# Altium schematic sheet RX.SchDoc
size A3
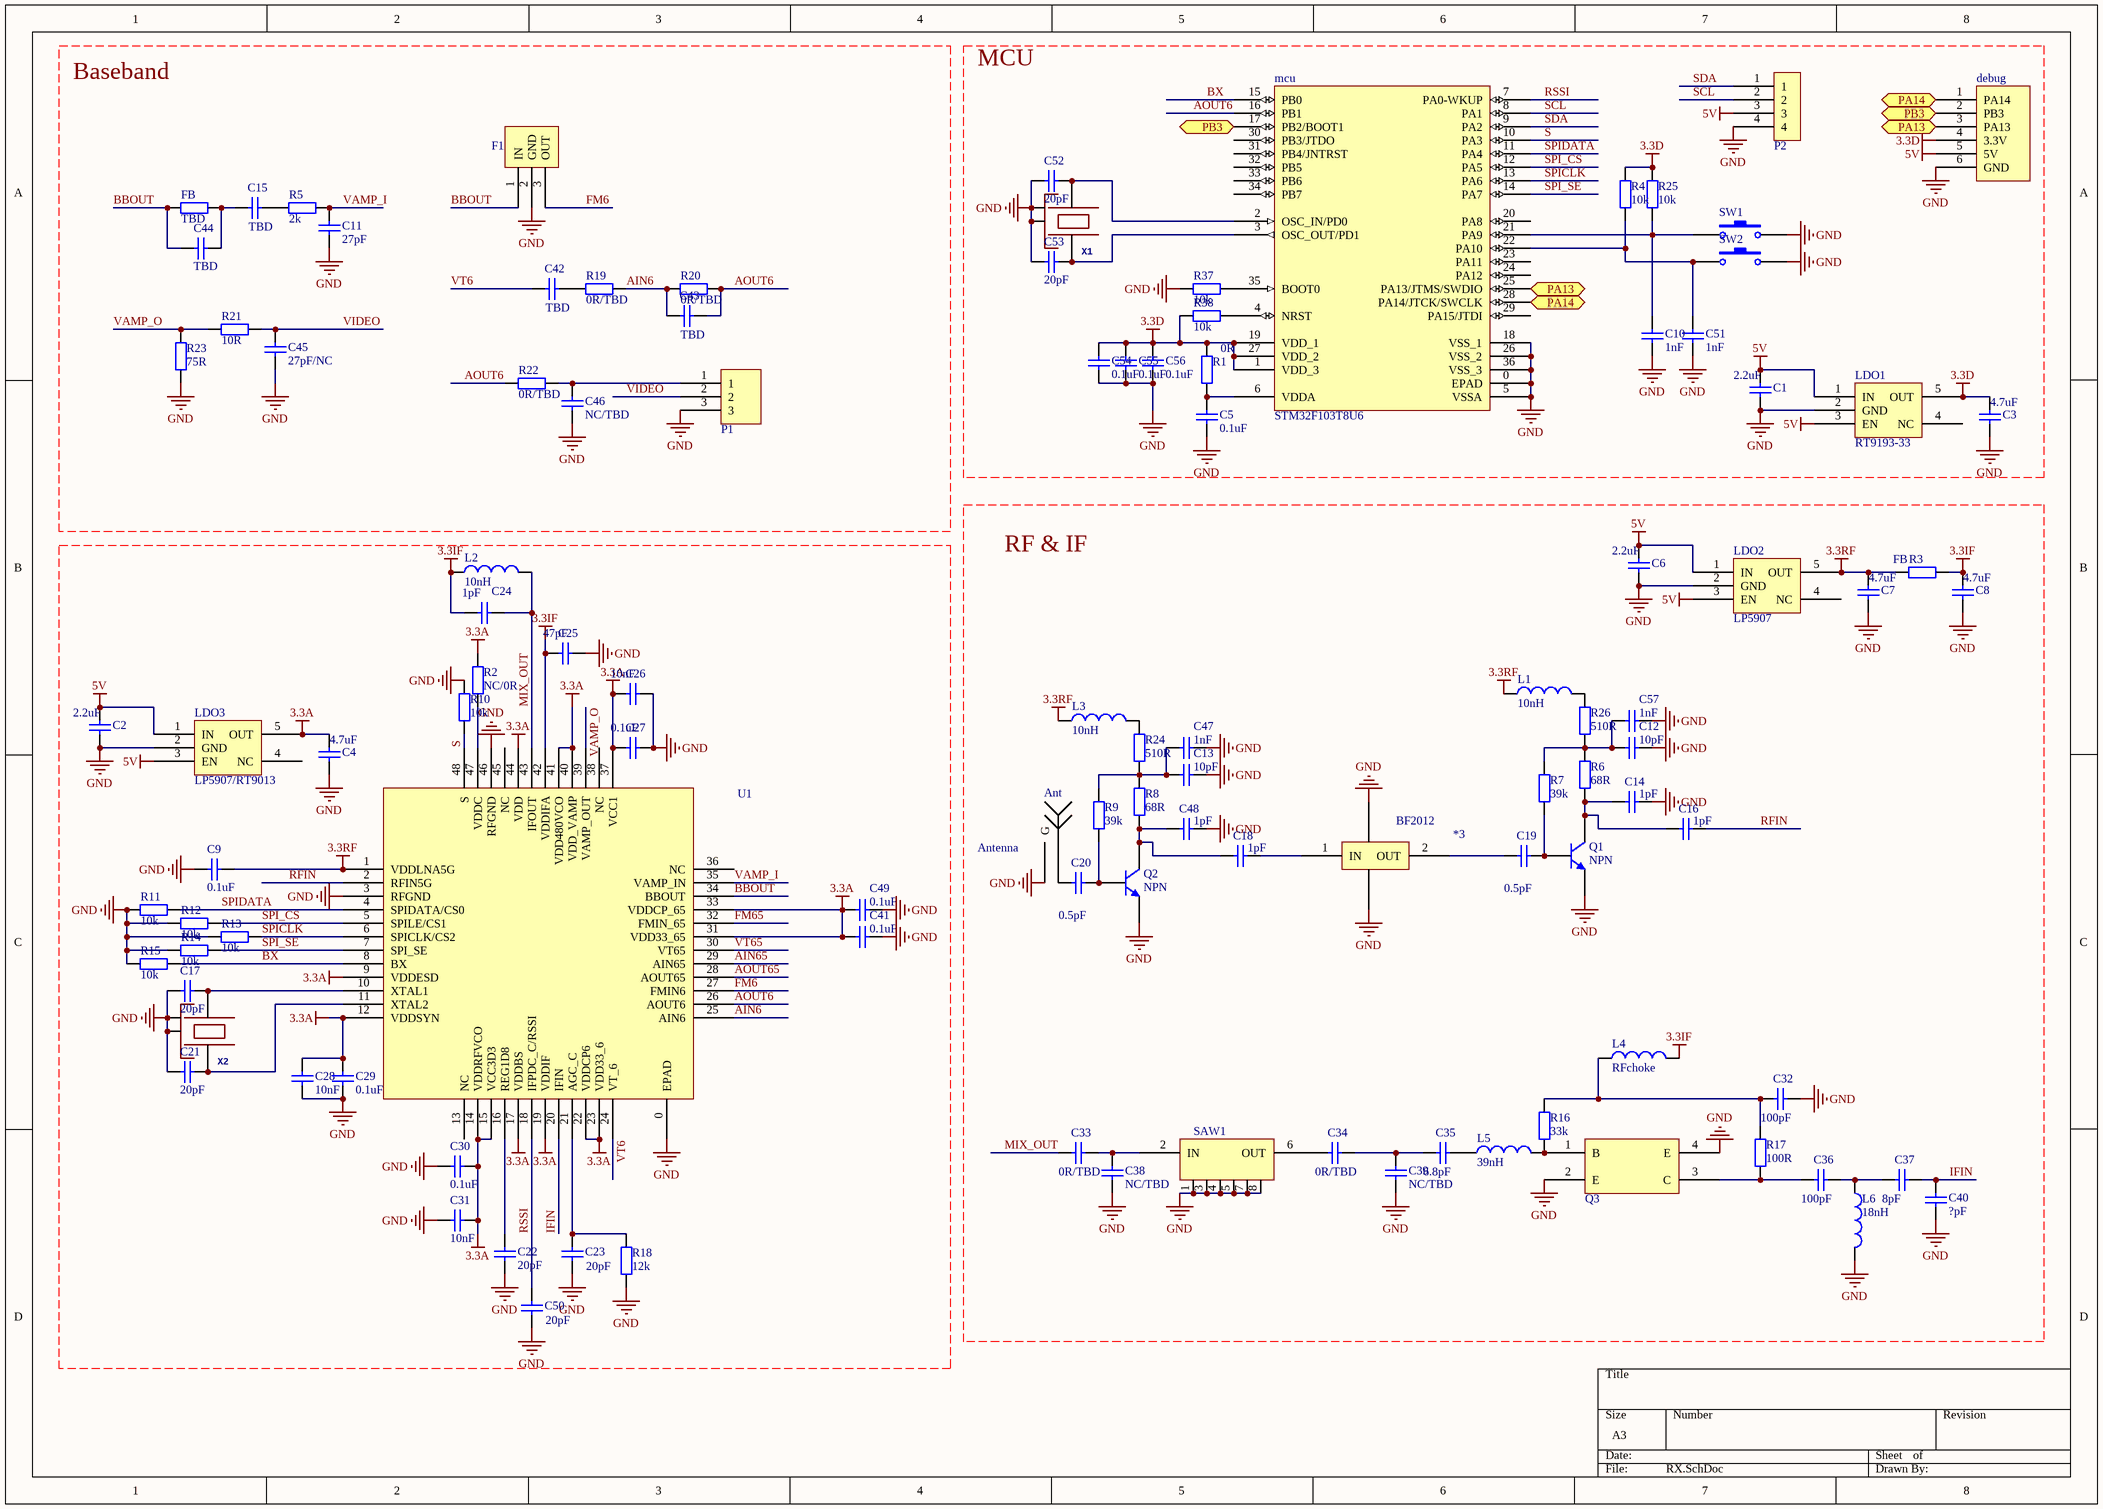
[diagram p0: RX.SchDoc]

## Parts
*3  BF2012  [BF2012]
Ant  Antenna  [SMA]
C1  2.2uF  [0603]
C2  2.2uF  [0603]
C3  4.7uF  [0805]
C4  4.7uF  [0805]
C5  value 0.1uF  [0402]  (hidden comment: Cap)
C6  2.2uF  [0603]
C7  4.7uF  [0805]
C8  4.7uF  [0805]
C9  0.1uF  [0402]
C10  1nF  [0402]
C11  27pF  [0402]
C12  10pF  [0402]
C13  10pF  [0402]
C14  1pF  [0402]
C15  TBD  [0805]
C16  1pF  [0402]
C17  value 20pF  [0402]  (hidden comment: Cap)
C18  1pF  [0402]
C19  0.5pF  [0402]
C20  0.5pF  [0402]
C21  value 20pF  [0402]  (hidden comment: Cap)
C22  value 20pF  [0402]  (hidden comment: Cap)
C23  value 20pF  [0402]  (hidden comment: Cap)
C24  1pF  [0402]
C25  47pF  [0402]
C26  10nF  [0402]
C27  0.1uF  [0402]
C28  value 10nF  [0402]  (hidden comment: Cap)
C29  value 0.1uF  [0402]  (hidden comment: Cap)
C30  0.1uF  [0402]
C31  10nF  [0402]
C32  100pF  [0402]
C33  0R/TBD  [0402]
C34  0R/TBD  [0402]
C35  6.8pF  [0402]
C36  100pF  [0402]
C37  8pF  [0402]
C38  NC/TBD  [0402]
C39  NC/TBD  [0402]
C40  ?pF  [0402]
C41  0.1uF  [0402]
C42  TBD  [0402]
C43  TBD  [0402]
C44  TBD  [0402]
C45  27pF/NC  [0402]
C46  NC/TBD  [0402]
C47  1nF  [0402]
C48  1pF  [0402]
C49  0.1uF  [0402]
C50  value 20pF  [0402]  (hidden comment: Cap)
C51  1nF  [0402]
C52  value 20pF  [0402]  (hidden comment: Cap)
C53  value 20pF  [0402]  (hidden comment: Cap)
C54  value 0.1uF  [0402]  (hidden comment: Cap)
C55  value 0.1uF  [0402]  (hidden comment: Cap)
C56  value 0.1uF  [0402]  (hidden comment: Cap)
C57  1nF  [0402]
debug  debug  [WFRSM125]  (value not drawn)
F1  6M/6.5M_Audio_filter  [3p]  (value not drawn)
FB  TBD  [0805]
L1  10nH  [0402-A]
L2  10nH  [0402-A]
L3  10nH  [0402-A]
L4  RFchoke  [0402-A]
L5  39nH  [0402-A]
L6  18nH  [0402-A]
LDO1  RT9193-33  [SOT23-5]
LDO2  LP5907  [SOT23-5]
LDO3  LP5907/RT9013  [SOT23-5]
mcu  STM32F103T8U6  [VFQN36_N]
P1  3P  [3p]  (value not drawn)
P2  4PSocket  [4pSocket]  (value not drawn)
Q1  NPN  [NESG3031M05]
Q2  NPN  [NESG3031M05]
Q3  RF_BJT  [SOT343-4(RF)]  (value not drawn)
R1  0R  [0402]
R2  NC/0R  [0402]
R3  FB  [0402]
R4  10k  [0402]
R5  2k  [0402]
R6  68R  [0402]
R7  39k  [0402]
R8  68R  [0402]
R9  39k  [0402]
R10  10k  [0402]
R11  10k  [0402]
R12  10k  [0402]
R13  10k  [0402]
R14  10k  [0402]
R15  10k  [0402]
R16  33k  [0402]
R17  100R  [0402]
R18  12k  [0402]
R19  0R/TBD  [0402]
R20  0R/TBD  [0402]
R21  10R  [0402]
R22  0R/TBD  [0402]
R23  75R  [0402]
R24  510R  [0402]
R25  10k  [0402]
R26  510R  [0402]
R37  value 10k  [0402]  (hidden comment: Res2)
R38  value 10k  [0402]  (hidden comment: Res2)
SAW1  NDF4010  [QCC-8]  (value not drawn)
SW1  SW-PB  [SW1]  (value not drawn)
SW2  SW-PB  [SW1]  (value not drawn)
U1  RTC6715  [RTC6715]  (value not drawn)
X1  24.000 KHz 3.2x2.5mm 8-10pf  [OSCILLATOR-3.2X2.5]  (value not drawn)
X2  24.000 KHz 3.2x2.5mm 8-10pf  [OSCILLATOR-3.2X2.5]  (value not drawn)

## Ports
PA13, PA14, PB3

## Nets
3.3A: C4.2 C26.2 C27.2 C28.2 C29.2 C30.2 C31.2 C41.2 C49.2 LDO3.5(OUT) R2.1 U1.9(VDDESD) U1.12(VDDSYN) U1.14(VDDRFVCO) U1.15(VCC3D3) U1.17(VDDBS) U1.19(VDDIF) U1.22(VDDCP6) U1.23(VDD33_6) U1.31(VDD33_65) U1.33(VDDCP_65) U1.37(VCC1) U1.40(VDD_VAMP) U1.41(VDD480VCO) U1.44(VDD)
3.3D: C3.2 C54.2 C55.2 C56.2 debug.4(3.3V) LDO1.5(OUT) mcu.1(VDD_3) mcu.19(VDD_1) mcu.27(VDD_2) R1.2 R4.2 R25.2 R38.2
3.3IF: C8.2 C24.2 C25.2 L2.1 L4.2 R3.1 U1.42(VDDIFA)
3.3RF: C7.2 C9.2 L1.1 L3.1 LDO2.5(OUT) R3.2 U1.1(VDDLNA5G)
5V: C1.2 C2.2 C6.2 debug.5(5V) LDO1.1(IN) LDO1.3(EN) LDO2.1(IN) LDO2.3(EN) LDO3.1(IN) LDO3.3(EN) P2.3
GND: *3.0(GND) Ant.GND(G) C1.1 C2.1 C3.1 C4.1 C5.1 C6.1 C7.1 C8.1 C9.1 C10.1 C11.1 C12.2 C13.2 C14.2 C17.1 C21.1 C22.1 C23.1 C25.1 C26.1 C27.1 C28.1 C29.1 C30.1 C31.1 C32.2 C38.1 C39.1 C40.1 C41.1 C45.1 C46.1 C47.2 C48.2 C49.1 C50.1 C51.1 C52.1 C53.1 C54.1 C55.1 C56.1 C57.2 debug.6(GND) F1.2(GND) L6.2 LDO1.2(GND) LDO2.2(GND) LDO3.2(GND) mcu.0(EPAD) mcu.5(VSSA) mcu.18(VSS_1) mcu.26(VSS_2) mcu.36(VSS_3) P1.3 P2.4 Q1.2(E) Q2.2(E) Q3.2(E) Q3.4(E) R10.2 R11.1 R12.1 R13.1 R14.1 R15.1 R18.1 R23.2 R37.2 SAW1.1(GND) SAW1.3(GND) SAW1.4(GND) SAW1.5(GND) SAW1.7(GND) SAW1.8(GND) SW1.2 SW2.2 U1.0(EPAD) U1.3(RFGND) U1.46(RFGND) X1.2(NC_2) X1.4(NC_4) X2.2(NC_2) X2.4(NC_4)
AIN6: C43.1 R19.1 R20.2 U1.25(AIN6)
AIN65: U1.29(AIN65)
AOUT6: C43.2 mcu.16(PB1) R20.1 R22.2 U1.26(AOUT6)
AOUT65: U1.28(AOUT65)
BBOUT: C44.2 F1.1(IN) FB.2 U1.34(BBOUT)
BX: mcu.15(PB0) R15.2 U1.8(BX)
FM6: F1.3(OUT) U1.27(FMIN6)
FM65: U1.32(FMIN_65)
IFIN: C37.2 C40.2 U1.20(IFIN)
MIX_OUT: C24.1 C33.1 L2.2 U1.43(IFOUT)
PA13: debug.3(PA13) mcu.25(PA13/JTMS/SWDIO) ; port PA13
PA14: debug.1(PA14) mcu.28(PA14/JTCK/SWCLK) ; port PA14
PB3: debug.2(PB3) mcu.17(PB2/BOOT1) ; port PB3
RFIN: C16.2 U1.2(RFIN5G)
RSSI: C50.2 mcu.7(PA0-WKUP) U1.18(IFPDC_C/RSSI)
S: mcu.10(PA3) R10.1 U1.48(S)
SCL: mcu.8(PA1) P2.2
SDA: mcu.9(PA2) P2.1
SPI_CS: mcu.12(PA5) R12.2 U1.5(SPILE/CS1)
SPI_SE: mcu.14(PA7) R14.2 U1.7(SPI_SE)
SPICLK: mcu.13(PA6) R13.2 U1.6(SPICLK/CS2)
SPIDATA: mcu.11(PA4) R11.2 U1.4(SPIDATA/CS0)
VAMP_I: C11.2 R5.1 U1.35(VAMP_IN)
VAMP_O: R21.2 R23.1 U1.39(VAMP_OUT)
VIDEO: C45.2 P1.2 R21.1
VT6: C42.1 U1.24(VT_6)
VT65: U1.30(VT65)
Net*3_1: *3.1(IN) C18.2
Net*3_2: *3.2(OUT) C19.1
NetAnt_1: Ant.1 C20.1
NetC5_2: C5.2 mcu.6(VDDA) R1.1
NetC10_2: C10.2 mcu.21(PA9) R25.1 SW1.1
NetC12_1: C12.1 C57.1 R6.1 R7.1 R26.1
NetC13_1: C13.1 C47.1 R8.1 R9.1 R24.1
NetC14_1: C14.1 C16.1 Q1.3(C) R6.2
NetC15_1: C15.1 C44.1 FB.1
NetC15_2: C15.2 R5.2
NetC17_2: C17.2 U1.10(XTAL1) X2.1
NetC18_1: C18.1 C48.1 Q2.3(C) R8.2
NetC19_2: C19.2 Q1.1(B) R7.2
NetC20_2: C20.2 Q2.1(B) R9.2
NetC21_2: C21.2 U1.11(XTAL2) X2.3
NetC22_2: C22.2 U1.16(REG1D8)
NetC23_2: C23.2 R18.2 U1.21(AGC_C)
NetC32_1: C32.1 L4.1 R16.2 R17.2
NetC33_2: C33.2 C38.2 SAW1.2(IN)
NetC34_1: C34.1 SAW1.6(OUT)
NetC34_2: C34.2 C35.1 C39.2
NetC35_2: C35.2 L5.1
NetC36_1: C36.1 Q3.3(C) R17.1
NetC36_2: C36.2 C37.1 L6.1
NetC42_2: C42.2 R19.2
NetC46_2: C46.2 P1.1 R22.1
NetC51_2: C51.2 mcu.22(PA10) R4.1 SW2.1
NetC52_2: C52.2 mcu.2(OSC_IN/PD0) X1.1
NetC53_2: C53.2 mcu.3(OSC_OUT/PD1) X1.3
NetL1_2: L1.2 R26.2
NetL3_2: L3.2 R24.2
NetL5_2: L5.2 Q3.1(B) R16.1
Netmcu_4: mcu.4(NRST) R38.1
Netmcu_35: mcu.35(BOOT0) R37.1
NetR2_2: R2.2 U1.47(VDDC)

Not connected (* = marked no-connect by the designer): LDO1 4(NC); LDO2 4(NC); LDO3 4(NC); mcu 20(PA8) 23(PA11) 24(PA12) 29(PA15/JTDI) 30(PB3/JTDO) 31(PB4/JNTRST) 32(PB5) 33(PB6) 34(PB7); U1 13(NC) 36(NC) 38(NC) 45(NC)

## Notes on the sheet
- Baseband
- MCU
- RF & IF

## Library data of the parts
C1-C57 = Cap: Capacitor; Published: 8-Jun-2000; LatestRevisionDate: 17-Jul-2002; LatestRevisionNote: Re-released for DXP Platform.; PackageReference: RAD-0.3; Publisher: Altium Limited; PackageDescription: Radial Cap, Thru-Hole; 2 Leads; 0.3 in Pin Spacing
FB R1-R26 R37 R38 = Res2: Resistor; Published: 8-Jun-2000; LatestRevisionDate: 17-Jul-2002; LatestRevisionNote: Re-released for DXP Platform.; PackageReference: AXIAL-0.4; Publisher: Altium Limited; PackageDescription: Axial Device, Thru-Hole; 2 Leads; 0.4 in Pin Spacing
L1-L6 = Inductor: Code_IEC: 1005; Published: 8-Jun-2000; LatestRevisionDate: 29-May-2009; LatestRevisionNote: IPC-7351 Footprint Added.; PackageReference: 0402-A; Publisher: Altium Limited; PackageDescription: Chip Inductor; Code_JEITA: 0402
LDO1 LDO3 = LP5907
mcu = STM32F103T8U6: STM32 ARM-based 32-bit MCU with 64 Kbytes Flash, 36-pin VFQFPN, Industrial Temperature; Published: *; DatasheetVersion: *; PackageVersion: *; PackageReference: *; Publisher: *; PackageDescription: *; ComponentLink1Description: *; ComponentLink1URL: *; ComponentLink2Description: *; ComponentLink2URL: *
Q1 Q2 = NPN: NPN Bipolar Transistor; Published: 8-Jun-2000; LatestRevisionDate: 17-Jul-2002; LatestRevisionNote: Re-released for DXP Platform.; PackageReference: TO-226-AA; Publisher: Altium Limited; PackageDescription: TO, Flat Index; 3 In-Line, Axial Leads; Body Dia. 4.8mm; Leads 0.55 x 0.51 mm (max); Code_JEDEC: TO-226-AA
SW1 SW2 = SW-PB: Switch; Published: 24-Mar-1999; LatestRevisionDate: 17-Jul-2002; LatestRevisionNote: Re-released for DXP Platform.; PackageReference: SPST-2; Publisher: Altium Limited; PackageDescription: Switch; 2 Leads
X1 X2 = OSCILLATOR-3.2X2.5: Crystal Oscillator in 3.2x2.5 SMD